# EAGLE schematic proto2 (EAGLE 6.6.0)
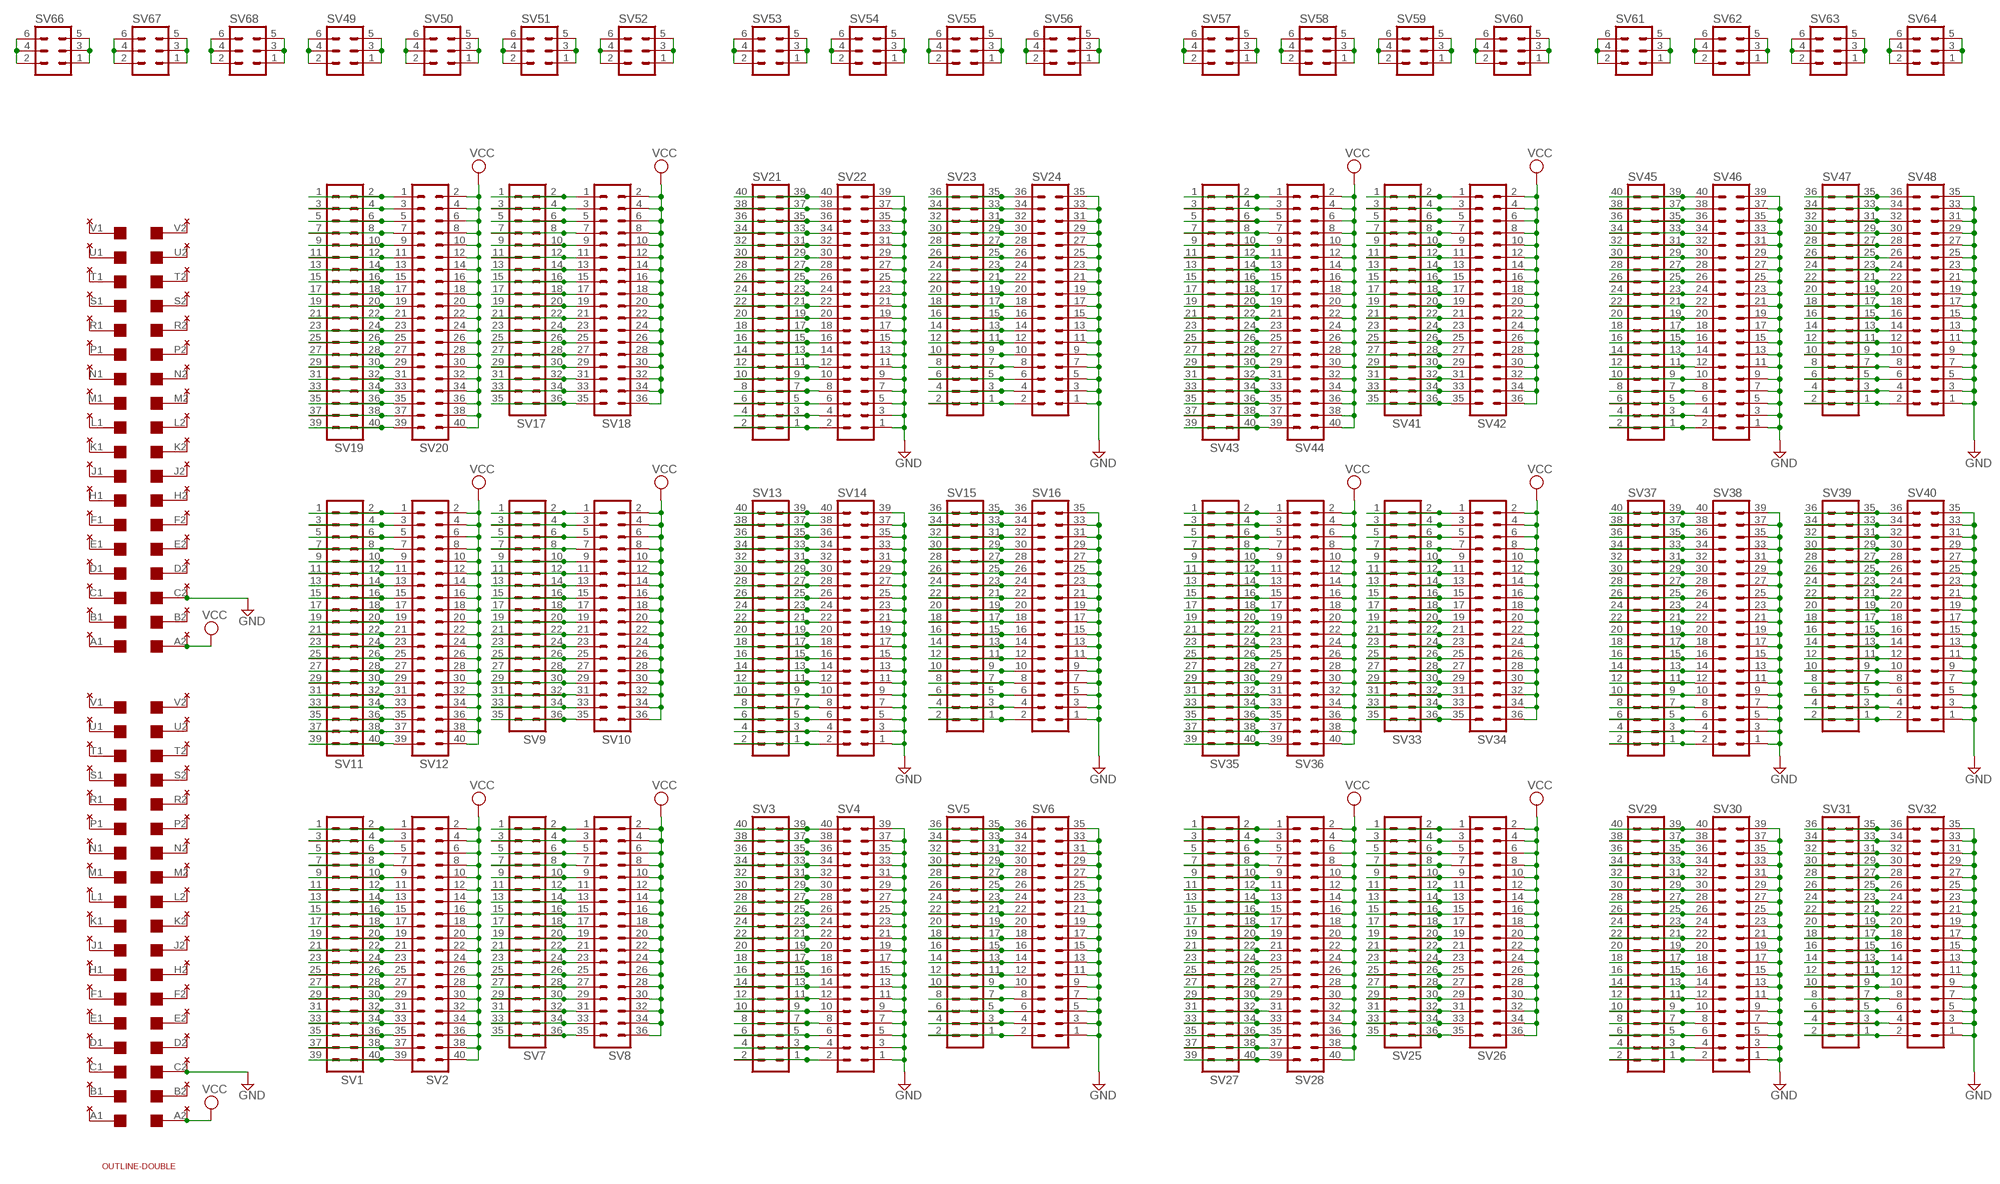
[diagram p0: schematic, sheet 1]

## Parts
A  EDGE-2CONNECTOR  [EDGE-CON2]
B  EDGE-2CONNECTOR  [EDGE-CON2]
SV1  MA20-2  [MA20-2]
SV2  MA20-2  [MA20-2]
SV3  MA20-2  [MA20-2]
SV4  MA20-2  [MA20-2]
SV5  MA18-2  [MA18-2]
SV6  MA18-2  [MA18-2]
SV7  MA18-2  [MA18-2]
SV8  MA18-2  [MA18-2]
SV9  MA18-2  [MA18-2]
SV10  MA18-2  [MA18-2]
SV11  MA20-2  [MA20-2]
SV12  MA20-2  [MA20-2]
SV13  MA20-2  [MA20-2]
SV14  MA20-2  [MA20-2]
SV15  MA18-2  [MA18-2]
SV16  MA18-2  [MA18-2]
SV17  MA18-2  [MA18-2]
SV18  MA18-2  [MA18-2]
SV19  MA20-2  [MA20-2]
SV20  MA20-2  [MA20-2]
SV21  MA20-2  [MA20-2]
SV22  MA20-2  [MA20-2]
SV23  MA18-2  [MA18-2]
SV24  MA18-2  [MA18-2]
SV25  MA18-2  [MA18-2]
SV26  MA18-2  [MA18-2]
SV27  MA20-2  [MA20-2]
SV28  MA20-2  [MA20-2]
SV29  MA20-2  [MA20-2]
SV30  MA20-2  [MA20-2]
SV31  MA18-2  [MA18-2]
SV32  MA18-2  [MA18-2]
SV33  MA18-2  [MA18-2]
SV34  MA18-2  [MA18-2]
SV35  MA20-2  [MA20-2]
SV36  MA20-2  [MA20-2]
SV37  MA20-2  [MA20-2]
SV38  MA20-2  [MA20-2]
SV39  MA18-2  [MA18-2]
SV40  MA18-2  [MA18-2]
SV41  MA18-2  [MA18-2]
SV42  MA18-2  [MA18-2]
SV43  MA20-2  [MA20-2]
SV44  MA20-2  [MA20-2]
SV45  MA20-2  [MA20-2]
SV46  MA20-2  [MA20-2]
SV47  MA18-2  [MA18-2]
SV48  MA18-2  [MA18-2]
SV49  MA03-2  [MA03-2]
SV50  MA03-2  [MA03-2]
SV51  MA03-2  [MA03-2]
SV52  MA03-2  [MA03-2]
SV53  MA03-2  [MA03-2]
SV54  MA03-2  [MA03-2]
SV55  MA03-2  [MA03-2]
SV56  MA03-2  [MA03-2]
SV57  MA03-2  [MA03-2]
SV58  MA03-2  [MA03-2]
SV59  MA03-2  [MA03-2]
SV60  MA03-2  [MA03-2]
SV61  MA03-2  [MA03-2]
SV62  MA03-2  [MA03-2]
SV63  MA03-2  [MA03-2]
SV64  MA03-2  [MA03-2]
SV66  MA03-2  [MA03-2]
SV67  MA03-2  [MA03-2]
SV68  MA03-2  [MA03-2]
U$3  THRU-HOLE2A  [THRU-HOLEA]
U$4  OUTLINE-DOUBLE  [DOUBLE]
U$5  THRU-HOLE2A  [THRU-HOLEA]

## Nets
GND: A.C2 B.C2 SV4.1 SV4.3 SV4.5 SV4.7 SV4.9 SV4.11 SV4.13 SV4.15 SV4.17 SV4.19 SV4.21 SV4.23 SV4.25 SV4.27 SV4.29 SV4.31 SV4.33 SV4.35 SV4.37 SV4.39 SV6.1 SV6.3 SV6.5 SV6.7 SV6.9 SV6.11 SV6.13 SV6.15 SV6.17 SV6.19 SV6.21 SV6.23 SV6.25 SV6.27 SV6.29 SV6.31 SV6.33 SV6.35 SV14.1 SV14.3 SV14.5 SV14.7 SV14.9 SV14.11 SV14.13 SV14.15 SV14.17 SV14.19 SV14.21 SV14.23 SV14.25 SV14.27 SV14.29 SV14.31 SV14.33 SV14.35 SV14.37 SV14.39 SV16.1 SV16.3 SV16.5 SV16.7 SV16.9 SV16.11 SV16.13 SV16.15 SV16.17 SV16.19 SV16.21 SV16.23 SV16.25 SV16.27 SV16.29 SV16.31 SV16.33 SV16.35 SV22.1 SV22.3 SV22.5 SV22.7 SV22.9 SV22.11 SV22.13 SV22.15 SV22.17 SV22.19 SV22.21 SV22.23 SV22.25 SV22.27 SV22.29 SV22.31 SV22.33 SV22.35 SV22.37 SV22.39 SV24.1 SV24.3 SV24.5 SV24.7 SV24.9 SV24.11 SV24.13 SV24.15 SV24.17 SV24.19 SV24.21 SV24.23 SV24.25 SV24.27 SV24.29 SV24.31 SV24.33 SV24.35 SV30.1 SV30.3 SV30.5 SV30.7 SV30.9 SV30.11 SV30.13 SV30.15 SV30.17 SV30.19 SV30.21 SV30.23 SV30.25 SV30.27 SV30.29 SV30.31 SV30.33 SV30.35 SV30.37 SV30.39 SV32.1 SV32.3 SV32.5 SV32.7 SV32.9 SV32.11 SV32.13 SV32.15 SV32.17 SV32.19 SV32.21 SV32.23 SV32.25 SV32.27 SV32.29 SV32.31 SV32.33 SV32.35 SV38.1 SV38.3 SV38.5 SV38.7 SV38.9 SV38.11 SV38.13 SV38.15 SV38.17 SV38.19 SV38.21 SV38.23 SV38.25 SV38.27 SV38.29 SV38.31 SV38.33 SV38.35 SV38.37 SV38.39 SV40.1 SV40.3 SV40.5 SV40.7 SV40.9 SV40.11 SV40.13 SV40.15 SV40.17 SV40.19 SV40.21 SV40.23 SV40.25 SV40.27 SV40.29 SV40.31 SV40.33 SV40.35 SV46.1 SV46.3 SV46.5 SV46.7 SV46.9 SV46.11 SV46.13 SV46.15 SV46.17 SV46.19 SV46.21 SV46.23 SV46.25 SV46.27 SV46.29 SV46.31 SV46.33 SV46.35 SV46.37 SV46.39 SV48.1 SV48.3 SV48.5 SV48.7 SV48.9 SV48.11 SV48.13 SV48.15 SV48.17 SV48.19 SV48.21 SV48.23 SV48.25 SV48.27 SV48.29 SV48.31 SV48.33 SV48.35 U$3.C2 U$5.C2
N$1: A.K2 U$3.K2
N$2: A.J2 U$3.J2
N$3: A.H2 U$3.H2
N$4: A.L2 U$3.L2
N$5: A.M2 U$3.M2
N$6: A.N2 U$3.N2
N$7: A.P2 U$3.P2
N$8: A.F2 U$3.F2
N$9: A.E2 U$3.E2
N$10: A.D2 U$3.D2
N$11: SV1.1 SV1.2 SV2.1
N$12: A.R2 U$3.R2
N$13: A.S2 U$3.S2
N$14: A.B2 U$3.B2
N$15: SV1.3 SV1.4 SV2.3
N$16: A.T2 U$3.T2
N$17: A.U2 U$3.U2
N$18: A.V2 U$3.V2
N$19: A.A1 U$3.A1
N$20: A.V1 U$3.V1
N$21: A.U1 U$3.U1
N$22: A.T1 U$3.T1
N$23: A.S1 U$3.S1
N$24: A.R1 U$3.R1
N$25: A.P1 U$3.P1
N$26: A.N1 U$3.N1
N$27: A.M1 U$3.M1
N$28: A.L1 U$3.L1
N$29: A.K1 U$3.K1
N$30: A.J1 U$3.J1
N$31: A.H1 U$3.H1
N$32: A.F1 U$3.F1
N$33: A.E1 U$3.E1
N$34: A.D1 U$3.D1
N$35: A.C1 U$3.C1
N$36: A.B1 U$3.B1
N$37: SV1.5 SV1.6 SV2.5
N$38: SV7.1 SV7.2 SV8.1
N$39: SV7.3 SV7.4 SV8.3
N$40: SV7.5 SV7.6 SV8.5
N$41: SV7.7 SV7.8 SV8.7
N$42: SV7.9 SV7.10 SV8.9
N$43: SV7.11 SV7.12 SV8.11
N$44: SV7.13 SV7.14 SV8.13
N$45: SV1.7 SV1.8 SV2.7
N$46: SV1.9 SV1.10 SV2.9
N$47: SV1.11 SV1.12 SV2.11
N$48: SV1.13 SV1.14 SV2.13
N$49: SV1.15 SV1.16 SV2.15
N$50: SV1.17 SV1.18 SV2.17
N$51: SV1.19 SV1.20 SV2.19
N$52: SV1.21 SV1.22 SV2.21
N$53: SV1.23 SV1.24 SV2.23
N$54: SV1.25 SV1.26 SV2.25
N$55: SV1.27 SV1.28 SV2.27
N$56: SV1.29 SV1.30 SV2.29
N$57: SV1.31 SV1.32 SV2.31
N$58: SV1.33 SV1.34 SV2.33
N$59: SV1.35 SV1.36 SV2.35
N$60: SV1.37 SV1.38 SV2.37
N$61: SV1.39 SV1.40 SV2.39
N$62: SV7.15 SV7.16 SV8.15
N$63: SV7.17 SV7.18 SV8.17
N$64: SV7.19 SV7.20 SV8.19
N$65: SV7.21 SV7.22 SV8.21
N$66: SV7.23 SV7.24 SV8.23
N$67: SV7.25 SV7.26 SV8.25
N$68: SV7.27 SV7.28 SV8.27
N$69: SV7.29 SV7.30 SV8.29
N$70: SV7.31 SV7.32 SV8.31
N$71: SV7.33 SV7.34 SV8.33
N$72: SV7.35 SV7.36 SV8.35
N$73: SV3.39 SV3.40 SV4.40
N$74: SV3.37 SV3.38 SV4.38
N$75: SV3.35 SV3.36 SV4.36
N$76: SV3.33 SV3.34 SV4.34
N$77: SV3.31 SV3.32 SV4.32
N$78: SV3.29 SV3.30 SV4.30
N$79: SV3.27 SV3.28 SV4.28
N$80: SV3.25 SV3.26 SV4.26
N$81: SV3.23 SV3.24 SV4.24
N$82: SV3.21 SV3.22 SV4.22
N$83: SV3.19 SV3.20 SV4.20
N$84: SV3.17 SV3.18 SV4.18
N$85: SV3.15 SV3.16 SV4.16
N$86: SV3.13 SV3.14 SV4.14
N$87: SV3.11 SV3.12 SV4.12
N$88: SV3.9 SV3.10 SV4.10
N$89: SV3.7 SV3.8 SV4.8
N$90: SV3.5 SV3.6 SV4.6
N$91: SV3.3 SV3.4 SV4.4
N$92: SV3.1 SV3.2 SV4.2
N$93: SV11.1 SV11.2 SV12.1
N$94: SV5.35 SV5.36 SV6.36
N$95: SV5.33 SV5.34 SV6.34
N$96: SV5.31 SV5.32 SV6.32
N$97: SV5.29 SV5.30 SV6.30
N$98: SV5.27 SV5.28 SV6.28
N$99: SV5.25 SV5.26 SV6.26
N$100: SV5.23 SV5.24 SV6.24
N$101: SV5.21 SV5.22 SV6.22
N$102: SV5.19 SV5.20 SV6.20
N$103: SV5.17 SV5.18 SV6.18
N$104: SV5.15 SV5.16 SV6.16
N$105: SV5.13 SV5.14 SV6.14
N$106: SV5.11 SV5.12 SV6.12
N$107: SV5.9 SV5.10 SV6.10
N$108: SV5.7 SV5.8 SV6.8
N$109: SV5.5 SV5.6 SV6.6
N$110: SV5.3 SV5.4 SV6.4
N$111: SV5.1 SV5.2 SV6.2
N$112: SV11.3 SV11.4 SV12.3
N$113: SV11.5 SV11.6 SV12.5
N$114: SV11.7 SV11.8 SV12.7
N$115: SV11.9 SV11.10 SV12.9
N$116: SV11.11 SV11.12 SV12.11
N$117: SV11.13 SV11.14 SV12.13
N$118: SV11.15 SV11.16 SV12.15
N$119: SV11.17 SV11.18 SV12.17
N$120: SV11.19 SV11.20 SV12.19
N$121: SV11.21 SV11.22 SV12.21
N$122: SV11.23 SV11.24 SV12.23
N$123: SV11.25 SV11.26 SV12.25
N$124: SV11.27 SV11.28 SV12.27
N$125: SV11.29 SV11.30 SV12.29
N$126: SV11.31 SV11.32 SV12.31
N$127: SV11.33 SV11.34 SV12.33
N$128: SV11.35 SV11.36 SV12.35
N$129: SV11.37 SV11.38 SV12.37
N$130: SV11.39 SV11.40 SV12.39
N$131: SV9.1 SV9.2 SV10.1
N$132: SV9.3 SV9.4 SV10.3
N$133: SV9.5 SV9.6 SV10.5
N$134: SV9.7 SV9.8 SV10.7
N$135: SV9.9 SV9.10 SV10.9
N$136: SV9.11 SV9.12 SV10.11
N$137: SV9.13 SV9.14 SV10.13
N$138: SV9.15 SV9.16 SV10.15
N$139: SV9.17 SV9.18 SV10.17
N$140: SV9.19 SV9.20 SV10.19
N$141: SV9.21 SV9.22 SV10.21
N$142: SV9.23 SV9.24 SV10.23
N$143: SV9.25 SV9.26 SV10.25
N$144: SV9.27 SV9.28 SV10.27
N$145: SV9.29 SV9.30 SV10.29
N$146: SV9.31 SV9.32 SV10.31
N$147: SV9.33 SV9.34 SV10.33
N$148: SV9.35 SV9.36 SV10.35
N$149: SV13.39 SV13.40 SV14.40
N$150: SV13.37 SV13.38 SV14.38
N$151: SV13.35 SV13.36 SV14.36
N$152: SV13.33 SV13.34 SV14.34
N$153: SV13.31 SV13.32 SV14.32
N$154: SV13.29 SV13.30 SV14.30
N$155: SV13.27 SV13.28 SV14.28
N$156: SV13.25 SV13.26 SV14.26
N$157: SV13.23 SV13.24 SV14.24
N$158: SV13.21 SV13.22 SV14.22
N$159: SV13.19 SV13.20 SV14.20
N$160: SV13.17 SV13.18 SV14.18
N$161: SV13.15 SV13.16 SV14.16
N$162: SV13.13 SV13.14 SV14.14
N$163: SV13.11 SV13.12 SV14.12
N$164: SV13.9 SV13.10 SV14.10
N$165: SV13.7 SV13.8 SV14.8
N$166: SV13.5 SV13.6 SV14.6
N$167: SV13.3 SV13.4 SV14.4
N$168: SV13.1 SV13.2 SV14.2
N$169: SV15.35 SV15.36 SV16.36
N$170: SV15.33 SV15.34 SV16.34
N$171: SV15.31 SV15.32 SV16.32
N$172: SV15.29 SV15.30 SV16.30
N$173: SV15.27 SV15.28 SV16.28
N$174: SV15.25 SV15.26 SV16.26
N$175: SV15.23 SV15.24 SV16.24
N$176: SV15.21 SV15.22 SV16.22
N$177: SV15.19 SV15.20 SV16.20
N$178: SV15.17 SV15.18 SV16.18
N$179: SV15.15 SV15.16 SV16.16
N$180: SV15.13 SV15.14 SV16.14
N$181: SV15.11 SV15.12 SV16.12
N$182: SV15.9 SV15.10 SV16.10
N$183: SV15.7 SV15.8 SV16.8
N$184: SV15.5 SV15.6 SV16.6
N$185: SV15.3 SV15.4 SV16.4
N$186: SV15.1 SV15.2 SV16.2
N$187: SV19.1 SV19.2 SV20.1
N$188: SV19.3 SV19.4 SV20.3
N$189: SV19.5 SV19.6 SV20.5
N$190: SV19.7 SV19.8 SV20.7
N$191: SV19.9 SV19.10 SV20.9
N$192: SV19.11 SV19.12 SV20.11
N$193: SV19.13 SV19.14 SV20.13
N$194: SV19.15 SV19.16 SV20.15
N$195: SV19.17 SV19.18 SV20.17
N$196: SV19.19 SV19.20 SV20.19
N$197: SV19.21 SV19.22 SV20.21
N$198: SV19.23 SV19.24 SV20.23
N$199: SV19.25 SV19.26 SV20.25
N$200: SV19.27 SV19.28 SV20.27
N$201: SV19.29 SV19.30 SV20.29
N$202: SV19.31 SV19.32 SV20.31
N$203: SV19.33 SV19.34 SV20.33
N$204: SV19.35 SV19.36 SV20.35
N$205: SV19.37 SV19.38 SV20.37
N$206: SV19.39 SV19.40 SV20.39
N$207: SV17.1 SV17.2 SV18.1
N$208: SV17.3 SV17.4 SV18.3
N$209: SV17.5 SV17.6 SV18.5
N$210: SV17.7 SV17.8 SV18.7
N$211: SV17.9 SV17.10 SV18.9
N$212: SV17.11 SV17.12 SV18.11
N$213: SV17.13 SV17.14 SV18.13
N$214: SV17.15 SV17.16 SV18.15
N$215: SV17.17 SV17.18 SV18.17
N$216: SV17.19 SV17.20 SV18.19
N$217: SV17.21 SV17.22 SV18.21
N$218: SV17.23 SV17.24 SV18.23
N$219: SV17.25 SV17.26 SV18.25
N$220: SV17.27 SV17.28 SV18.27
N$221: SV17.29 SV17.30 SV18.29
N$222: SV17.31 SV17.32 SV18.31
N$223: SV17.33 SV17.34 SV18.33
N$224: SV17.35 SV17.36 SV18.35
N$225: SV21.39 SV21.40 SV22.40
N$226: SV21.37 SV21.38 SV22.38
N$227: SV21.35 SV21.36 SV22.36
N$228: SV21.33 SV21.34 SV22.34
N$229: SV21.31 SV21.32 SV22.32
N$230: SV21.29 SV21.30 SV22.30
N$231: SV21.27 SV21.28 SV22.28
N$232: SV21.25 SV21.26 SV22.26
N$233: SV21.23 SV21.24 SV22.24
N$234: SV21.21 SV21.22 SV22.22
N$235: SV21.19 SV21.20 SV22.20
N$236: SV21.17 SV21.18 SV22.18
N$237: SV21.15 SV21.16 SV22.16
N$238: SV21.13 SV21.14 SV22.14
N$239: SV21.11 SV21.12 SV22.12
N$240: SV21.9 SV21.10 SV22.10
N$241: SV21.7 SV21.8 SV22.8
N$242: SV21.5 SV21.6 SV22.6
N$243: SV21.3 SV21.4 SV22.4
N$244: SV21.1 SV21.2 SV22.2
N$245: SV23.35 SV23.36 SV24.36
N$246: SV23.33 SV23.34 SV24.34
N$247: SV23.31 SV23.32 SV24.32
N$248: SV23.29 SV23.30 SV24.30
N$249: SV23.27 SV23.28 SV24.28
N$250: SV23.25 SV23.26 SV24.26
N$251: SV23.23 SV23.24 SV24.24
N$252: SV23.21 SV23.22 SV24.22
N$253: SV23.19 SV23.20 SV24.20
N$254: SV23.17 SV23.18 SV24.18
N$255: SV23.15 SV23.16 SV24.16
N$256: SV23.13 SV23.14 SV24.14
N$257: SV23.11 SV23.12 SV24.12
N$258: SV23.9 SV23.10 SV24.10
N$259: SV23.7 SV23.8 SV24.8
N$260: SV23.5 SV23.6 SV24.6
N$261: SV23.3 SV23.4 SV24.4
N$262: SV23.1 SV23.2 SV24.2
N$263: B.K2 U$5.K2
N$264: B.J2 U$5.J2
N$265: B.H2 U$5.H2
N$266: B.L2 U$5.L2
N$267: B.M2 U$5.M2
N$268: B.N2 U$5.N2
N$269: B.P2 U$5.P2
N$270: B.F2 U$5.F2
N$271: B.E2 U$5.E2
N$272: B.D2 U$5.D2
N$273: B.R2 U$5.R2
N$274: B.S2 U$5.S2
N$275: B.B2 U$5.B2
N$276: B.T2 U$5.T2
N$277: B.U2 U$5.U2
N$278: B.V2 U$5.V2
N$279: B.A1 U$5.A1
N$280: B.V1 U$5.V1
N$281: B.U1 U$5.U1
N$282: B.T1 U$5.T1
N$283: B.S1 U$5.S1
N$284: B.R1 U$5.R1
N$285: B.P1 U$5.P1
N$286: B.N1 U$5.N1
N$287: B.M1 U$5.M1
N$288: B.L1 U$5.L1
N$289: B.K1 U$5.K1
N$290: B.J1 U$5.J1
N$291: B.H1 U$5.H1
N$292: B.F1 U$5.F1
N$293: B.E1 U$5.E1
N$294: B.D1 U$5.D1
N$295: B.C1 U$5.C1
N$296: B.B1 U$5.B1
N$297: SV27.1 SV27.2 SV28.1
N$298: SV27.3 SV27.4 SV28.3
N$299: SV27.5 SV27.6 SV28.5
N$300: SV27.7 SV27.8 SV28.7
N$301: SV27.9 SV27.10 SV28.9
N$302: SV27.11 SV27.12 SV28.11
N$303: SV27.13 SV27.14 SV28.13
N$304: SV27.15 SV27.16 SV28.15
N$305: SV27.17 SV27.18 SV28.17
N$306: SV27.19 SV27.20 SV28.19
N$307: SV27.21 SV27.22 SV28.21
N$308: SV27.23 SV27.24 SV28.23
N$309: SV27.25 SV27.26 SV28.25
N$310: SV27.27 SV27.28 SV28.27
N$311: SV27.29 SV27.30 SV28.29
N$312: SV27.31 SV27.32 SV28.31
N$313: SV27.33 SV27.34 SV28.33
N$314: SV27.35 SV27.36 SV28.35
N$315: SV27.37 SV27.38 SV28.37
N$316: SV27.39 SV27.40 SV28.39
N$317: SV25.1 SV25.2 SV26.1
N$318: SV25.3 SV25.4 SV26.3
N$319: SV25.5 SV25.6 SV26.5
N$320: SV25.7 SV25.8 SV26.7
N$321: SV25.9 SV25.10 SV26.9
N$322: SV25.11 SV25.12 SV26.11
N$323: SV25.13 SV25.14 SV26.13
N$324: SV25.15 SV25.16 SV26.15
N$325: SV25.17 SV25.18 SV26.17
N$326: SV25.19 SV25.20 SV26.19
N$327: SV25.21 SV25.22 SV26.21
N$328: SV25.23 SV25.24 SV26.23
N$329: SV25.25 SV25.26 SV26.25
N$330: SV25.27 SV25.28 SV26.27
N$331: SV25.29 SV25.30 SV26.29
N$332: SV25.31 SV25.32 SV26.31
N$333: SV25.33 SV25.34 SV26.33
N$334: SV25.35 SV25.36 SV26.35
N$335: SV29.39 SV29.40 SV30.40
N$336: SV29.37 SV29.38 SV30.38
N$337: SV29.35 SV29.36 SV30.36
N$338: SV29.33 SV29.34 SV30.34
N$339: SV29.31 SV29.32 SV30.32
N$340: SV29.29 SV29.30 SV30.30
N$341: SV29.27 SV29.28 SV30.28
N$342: SV29.25 SV29.26 SV30.26
N$343: SV29.23 SV29.24 SV30.24
N$344: SV29.21 SV29.22 SV30.22
N$345: SV29.19 SV29.20 SV30.20
N$346: SV29.17 SV29.18 SV30.18
N$347: SV29.15 SV29.16 SV30.16
N$348: SV29.13 SV29.14 SV30.14
N$349: SV29.11 SV29.12 SV30.12
N$350: SV29.9 SV29.10 SV30.10
N$351: SV29.7 SV29.8 SV30.8
N$352: SV29.5 SV29.6 SV30.6
N$353: SV29.3 SV29.4 SV30.4
N$354: SV29.1 SV29.2 SV30.2
N$355: SV31.35 SV31.36 SV32.36
N$356: SV31.33 SV31.34 SV32.34
N$357: SV31.31 SV31.32 SV32.32
N$358: SV31.29 SV31.30 SV32.30
N$359: SV31.27 SV31.28 SV32.28
N$360: SV31.25 SV31.26 SV32.26
N$361: SV31.23 SV31.24 SV32.24
N$362: SV31.21 SV31.22 SV32.22
N$363: SV31.19 SV31.20 SV32.20
N$364: SV31.17 SV31.18 SV32.18
N$365: SV31.15 SV31.16 SV32.16
N$366: SV31.13 SV31.14 SV32.14
N$367: SV31.11 SV31.12 SV32.12
N$368: SV31.9 SV31.10 SV32.10
N$369: SV31.7 SV31.8 SV32.8
N$370: SV31.5 SV31.6 SV32.6
N$371: SV31.3 SV31.4 SV32.4
N$372: SV31.1 SV31.2 SV32.2
N$373: SV35.1 SV35.2 SV36.1
N$374: SV35.3 SV35.4 SV36.3
N$375: SV35.5 SV35.6 SV36.5
N$376: SV35.7 SV35.8 SV36.7
N$377: SV35.9 SV35.10 SV36.9
N$378: SV35.11 SV35.12 SV36.11
N$379: SV35.13 SV35.14 SV36.13
N$380: SV35.15 SV35.16 SV36.15
N$381: SV35.17 SV35.18 SV36.17
N$382: SV35.19 SV35.20 SV36.19
N$383: SV35.21 SV35.22 SV36.21
N$384: SV35.23 SV35.24 SV36.23
N$385: SV35.25 SV35.26 SV36.25
N$386: SV35.27 SV35.28 SV36.27
N$387: SV35.29 SV35.30 SV36.29
N$388: SV35.31 SV35.32 SV36.31
N$389: SV35.33 SV35.34 SV36.33
N$390: SV35.35 SV35.36 SV36.35
N$391: SV35.37 SV35.38 SV36.37
N$392: SV35.39 SV35.40 SV36.39
N$393: SV33.1 SV33.2 SV34.1
N$394: SV33.3 SV33.4 SV34.3
N$395: SV33.5 SV33.6 SV34.5
N$396: SV33.7 SV33.8 SV34.7
N$397: SV33.9 SV33.10 SV34.9
N$398: SV33.11 SV33.12 SV34.11
N$399: SV33.13 SV33.14 SV34.13
N$400: SV33.15 SV33.16 SV34.15
N$401: SV33.17 SV33.18 SV34.17
N$402: SV33.19 SV33.20 SV34.19
N$403: SV33.21 SV33.22 SV34.21
N$404: SV33.23 SV33.24 SV34.23
N$405: SV33.25 SV33.26 SV34.25
N$406: SV33.27 SV33.28 SV34.27
N$407: SV33.29 SV33.30 SV34.29
N$408: SV33.31 SV33.32 SV34.31
N$409: SV33.33 SV33.34 SV34.33
N$410: SV33.35 SV33.36 SV34.35
N$411: SV37.39 SV37.40 SV38.40
N$412: SV37.37 SV37.38 SV38.38
N$413: SV37.35 SV37.36 SV38.36
N$414: SV37.33 SV37.34 SV38.34
N$415: SV37.31 SV37.32 SV38.32
N$416: SV37.29 SV37.30 SV38.30
N$417: SV37.27 SV37.28 SV38.28
N$418: SV37.25 SV37.26 SV38.26
N$419: SV37.23 SV37.24 SV38.24
N$420: SV37.21 SV37.22 SV38.22
N$421: SV37.19 SV37.20 SV38.20
N$422: SV37.17 SV37.18 SV38.18
N$423: SV37.15 SV37.16 SV38.16
N$424: SV37.13 SV37.14 SV38.14
N$425: SV37.11 SV37.12 SV38.12
N$426: SV37.9 SV37.10 SV38.10
N$427: SV37.7 SV37.8 SV38.8
N$428: SV37.5 SV37.6 SV38.6
N$429: SV37.3 SV37.4 SV38.4
N$430: SV37.1 SV37.2 SV38.2
N$431: SV39.35 SV39.36 SV40.36
N$432: SV39.33 SV39.34 SV40.34
N$433: SV39.31 SV39.32 SV40.32
N$434: SV39.29 SV39.30 SV40.30
N$435: SV39.27 SV39.28 SV40.28
N$436: SV39.25 SV39.26 SV40.26
N$437: SV39.23 SV39.24 SV40.24
N$438: SV39.21 SV39.22 SV40.22
N$439: SV39.19 SV39.20 SV40.20
N$440: SV39.17 SV39.18 SV40.18
N$441: SV39.15 SV39.16 SV40.16
N$442: SV39.13 SV39.14 SV40.14
N$443: SV39.11 SV39.12 SV40.12
N$444: SV39.9 SV39.10 SV40.10
N$445: SV39.7 SV39.8 SV40.8
N$446: SV39.5 SV39.6 SV40.6
N$447: SV39.3 SV39.4 SV40.4
N$448: SV39.1 SV39.2 SV40.2
N$449: SV43.1 SV43.2 SV44.1
N$450: SV43.3 SV43.4 SV44.3
N$451: SV43.5 SV43.6 SV44.5
N$452: SV43.7 SV43.8 SV44.7
N$453: SV43.9 SV43.10 SV44.9
N$454: SV43.11 SV43.12 SV44.11
N$455: SV43.13 SV43.14 SV44.13
N$456: SV43.15 SV43.16 SV44.15
N$457: SV43.17 SV43.18 SV44.17
N$458: SV43.19 SV43.20 SV44.19
N$459: SV43.21 SV43.22 SV44.21
N$460: SV43.23 SV43.24 SV44.23
N$461: SV43.25 SV43.26 SV44.25
N$462: SV43.27 SV43.28 SV44.27
N$463: SV43.29 SV43.30 SV44.29
N$464: SV43.31 SV43.32 SV44.31
N$465: SV43.33 SV43.34 SV44.33
N$466: SV43.35 SV43.36 SV44.35
N$467: SV43.37 SV43.38 SV44.37
N$468: SV43.39 SV43.40 SV44.39
N$469: SV41.1 SV41.2 SV42.1
N$470: SV41.3 SV41.4 SV42.3
N$471: SV41.5 SV41.6 SV42.5
N$472: SV41.7 SV41.8 SV42.7
N$473: SV41.9 SV41.10 SV42.9
N$474: SV41.11 SV41.12 SV42.11
N$475: SV41.13 SV41.14 SV42.13
N$476: SV41.15 SV41.16 SV42.15
N$477: SV41.17 SV41.18 SV42.17
N$478: SV41.19 SV41.20 SV42.19
N$479: SV41.21 SV41.22 SV42.21
N$480: SV41.23 SV41.24 SV42.23
N$481: SV41.25 SV41.26 SV42.25
N$482: SV41.27 SV41.28 SV42.27
N$483: SV41.29 SV41.30 SV42.29
N$484: SV41.31 SV41.32 SV42.31
N$485: SV41.33 SV41.34 SV42.33
N$486: SV41.35 SV41.36 SV42.35
N$487: SV45.39 SV45.40 SV46.40
N$488: SV45.37 SV45.38 SV46.38
N$489: SV45.35 SV45.36 SV46.36
N$490: SV45.33 SV45.34 SV46.34
N$491: SV45.31 SV45.32 SV46.32
N$492: SV45.29 SV45.30 SV46.30
N$493: SV45.27 SV45.28 SV46.28
N$494: SV45.25 SV45.26 SV46.26
N$495: SV45.23 SV45.24 SV46.24
N$496: SV45.21 SV45.22 SV46.22
N$497: SV45.19 SV45.20 SV46.20
N$498: SV45.17 SV45.18 SV46.18
N$499: SV45.15 SV45.16 SV46.16
N$500: SV45.13 SV45.14 SV46.14
N$501: SV45.11 SV45.12 SV46.12
N$502: SV45.9 SV45.10 SV46.10
N$503: SV45.7 SV45.8 SV46.8
N$504: SV45.5 SV45.6 SV46.6
N$505: SV45.3 SV45.4 SV46.4
N$506: SV45.1 SV45.2 SV46.2
N$507: SV47.35 SV47.36 SV48.36
N$508: SV47.33 SV47.34 SV48.34
N$509: SV47.31 SV47.32 SV48.32
N$510: SV47.29 SV47.30 SV48.30
N$511: SV47.27 SV47.28 SV48.28
N$512: SV47.25 SV47.26 SV48.26
N$513: SV47.23 SV47.24 SV48.24
N$514: SV47.21 SV47.22 SV48.22
N$515: SV47.19 SV47.20 SV48.20
N$516: SV47.17 SV47.18 SV48.18
N$517: SV47.15 SV47.16 SV48.16
N$518: SV47.13 SV47.14 SV48.14
N$519: SV47.11 SV47.12 SV48.12
N$520: SV47.9 SV47.10 SV48.10
N$521: SV47.7 SV47.8 SV48.8
N$522: SV47.5 SV47.6 SV48.6
N$523: SV47.3 SV47.4 SV48.4
N$524: SV47.1 SV47.2 SV48.2
N$525: SV66.2 SV66.4 SV66.6
N$526: SV66.1 SV66.3 SV66.5
N$527: SV67.2 SV67.4 SV67.6
N$528: SV67.1 SV67.3 SV67.5
N$529: SV68.2 SV68.4 SV68.6
N$530: SV68.1 SV68.3 SV68.5
N$531: SV49.2 SV49.4 SV49.6
N$532: SV49.1 SV49.3 SV49.5
N$533: SV50.2 SV50.4 SV50.6
N$534: SV50.1 SV50.3 SV50.5
N$535: SV51.2 SV51.4 SV51.6
N$536: SV51.1 SV51.3 SV51.5
N$537: SV52.1 SV52.3 SV52.5
N$538: SV52.2 SV52.4 SV52.6
N$539: SV53.2 SV53.4 SV53.6
N$540: SV53.1 SV53.3 SV53.5
N$541: SV54.2 SV54.4 SV54.6
N$542: SV54.1 SV54.3 SV54.5
N$543: SV55.2 SV55.4 SV55.6
N$544: SV55.1 SV55.3 SV55.5
N$545: SV56.2 SV56.4 SV56.6
N$546: SV56.1 SV56.3 SV56.5
N$547: SV57.2 SV57.4 SV57.6
N$548: SV57.1 SV57.3 SV57.5
N$549: SV58.2 SV58.4 SV58.6
N$550: SV58.1 SV58.3 SV58.5
N$551: SV59.2 SV59.4 SV59.6
N$552: SV59.1 SV59.3 SV59.5
N$553: SV60.2 SV60.4 SV60.6
N$554: SV60.1 SV60.3 SV60.5
N$555: SV61.2 SV61.4 SV61.6
N$556: SV61.1 SV61.3 SV61.5
N$557: SV62.2 SV62.4 SV62.6
N$558: SV62.1 SV62.3 SV62.5
N$559: SV63.2 SV63.4 SV63.6
N$560: SV63.1 SV63.3 SV63.5
N$561: SV64.2 SV64.4 SV64.6
N$562: SV64.1 SV64.3 SV64.5
VCC: A.A2 B.A2 SV2.2 SV2.4 SV2.6 SV2.8 SV2.10 SV2.12 SV2.14 SV2.16 SV2.18 SV2.20 SV2.22 SV2.24 SV2.26 SV2.28 SV2.30 SV2.32 SV2.34 SV2.36 SV2.38 SV2.40 SV8.2 SV8.4 SV8.6 SV8.8 SV8.10 SV8.12 SV8.14 SV8.16 SV8.18 SV8.20 SV8.22 SV8.24 SV8.26 SV8.28 SV8.30 SV8.32 SV8.34 SV8.36 SV10.2 SV10.4 SV10.6 SV10.8 SV10.10 SV10.12 SV10.14 SV10.16 SV10.18 SV10.20 SV10.22 SV10.24 SV10.26 SV10.28 SV10.30 SV10.32 SV10.34 SV10.36 SV12.2 SV12.4 SV12.6 SV12.8 SV12.10 SV12.12 SV12.14 SV12.16 SV12.18 SV12.20 SV12.22 SV12.24 SV12.26 SV12.28 SV12.30 SV12.32 SV12.34 SV12.36 SV12.38 SV12.40 SV18.2 SV18.4 SV18.6 SV18.8 SV18.10 SV18.12 SV18.14 SV18.16 SV18.18 SV18.20 SV18.22 SV18.24 SV18.26 SV18.28 SV18.30 SV18.32 SV18.34 SV18.36 SV20.2 SV20.4 SV20.6 SV20.8 SV20.10 SV20.12 SV20.14 SV20.16 SV20.18 SV20.20 SV20.22 SV20.24 SV20.26 SV20.28 SV20.30 SV20.32 SV20.34 SV20.36 SV20.38 SV20.40 SV26.2 SV26.4 SV26.6 SV26.8 SV26.10 SV26.12 SV26.14 SV26.16 SV26.18 SV26.20 SV26.22 SV26.24 SV26.26 SV26.28 SV26.30 SV26.32 SV26.34 SV26.36 SV28.2 SV28.4 SV28.6 SV28.8 SV28.10 SV28.12 SV28.14 SV28.16 SV28.18 SV28.20 SV28.22 SV28.24 SV28.26 SV28.28 SV28.30 SV28.32 SV28.34 SV28.36 SV28.38 SV28.40 SV34.2 SV34.4 SV34.6 SV34.8 SV34.10 SV34.12 SV34.14 SV34.16 SV34.18 SV34.20 SV34.22 SV34.24 SV34.26 SV34.28 SV34.30 SV34.32 SV34.34 SV34.36 SV36.2 SV36.4 SV36.6 SV36.8 SV36.10 SV36.12 SV36.14 SV36.16 SV36.18 SV36.20 SV36.22 SV36.24 SV36.26 SV36.28 SV36.30 SV36.32 SV36.34 SV36.36 SV36.38 SV36.40 SV42.2 SV42.4 SV42.6 SV42.8 SV42.10 SV42.12 SV42.14 SV42.16 SV42.18 SV42.20 SV42.22 SV42.24 SV42.26 SV42.28 SV42.30 SV42.32 SV42.34 SV42.36 SV44.2 SV44.4 SV44.6 SV44.8 SV44.10 SV44.12 SV44.14 SV44.16 SV44.18 SV44.20 SV44.22 SV44.24 SV44.26 SV44.28 SV44.30 SV44.32 SV44.34 SV44.36 SV44.38 SV44.40 U$3.A2 U$5.A2

## Library data of the parts
A B = dec-con:EDGE-2: Double-Sided DEC edge connector.
SV1-SV4 SV11-SV14 SV19-SV22 SV27-SV30 SV35-SV38 SV43-SV46 = con-lstb:MA20-2: PIN HEADER; OC_FARNELL: unknown; OC_NEWARK: unknown
SV5-SV10 SV15-SV18 SV23-SV26 SV31-SV34 SV39-SV42 SV47 SV48 = con-lstb:MA18-2: PIN HEADER; OC_FARNELL: unknown; OC_NEWARK: unknown
SV49-SV64 SV66-SV68 = con-lstb:MA03-2: PIN HEADER; OC_FARNELL: unknown; OC_NEWARK: unknown
U$3 U$5 = dec-con:THRU-HOLE2: Thru-Hole addition to double-sided edge connector.
U$4 = dec-con:OUTLINE-*: Board outlines for DEC boards.

## Net classes
0 default: width 0.635 mm